# Altium schematic sheet USB High Speed.SchDoc
size A3; Company Name: Renesas Electronics America; CompanyURL: www.renesas.com; PageSetup: Record=PageOptions|CenterHorizontal=True|CenterVertical=True|PrintScale=1.00|XCorrection=1.00|YCorrection=1.00|PrintKind=1|BorderSize=5000000|LeftOffset=0|BottomOffset=0|Orientation=2|PaperLength=1000|PaperWidth=1000|Scale=100|PaperSource=7|PrintQuality=-4|MediaType=1|DitherType=10|PaperKind=A5 148x210mm|PrintScaleMode=1; ReleaseDate: 16.09.2025; Version: MP; SPICEModelCache: <root> / <DocumentId>LYYELOHJ</DocumentId> / </root>; SheetNumber: 14; SheetTotal: 18; VariantNumber: 0; DSheetNumber: 1
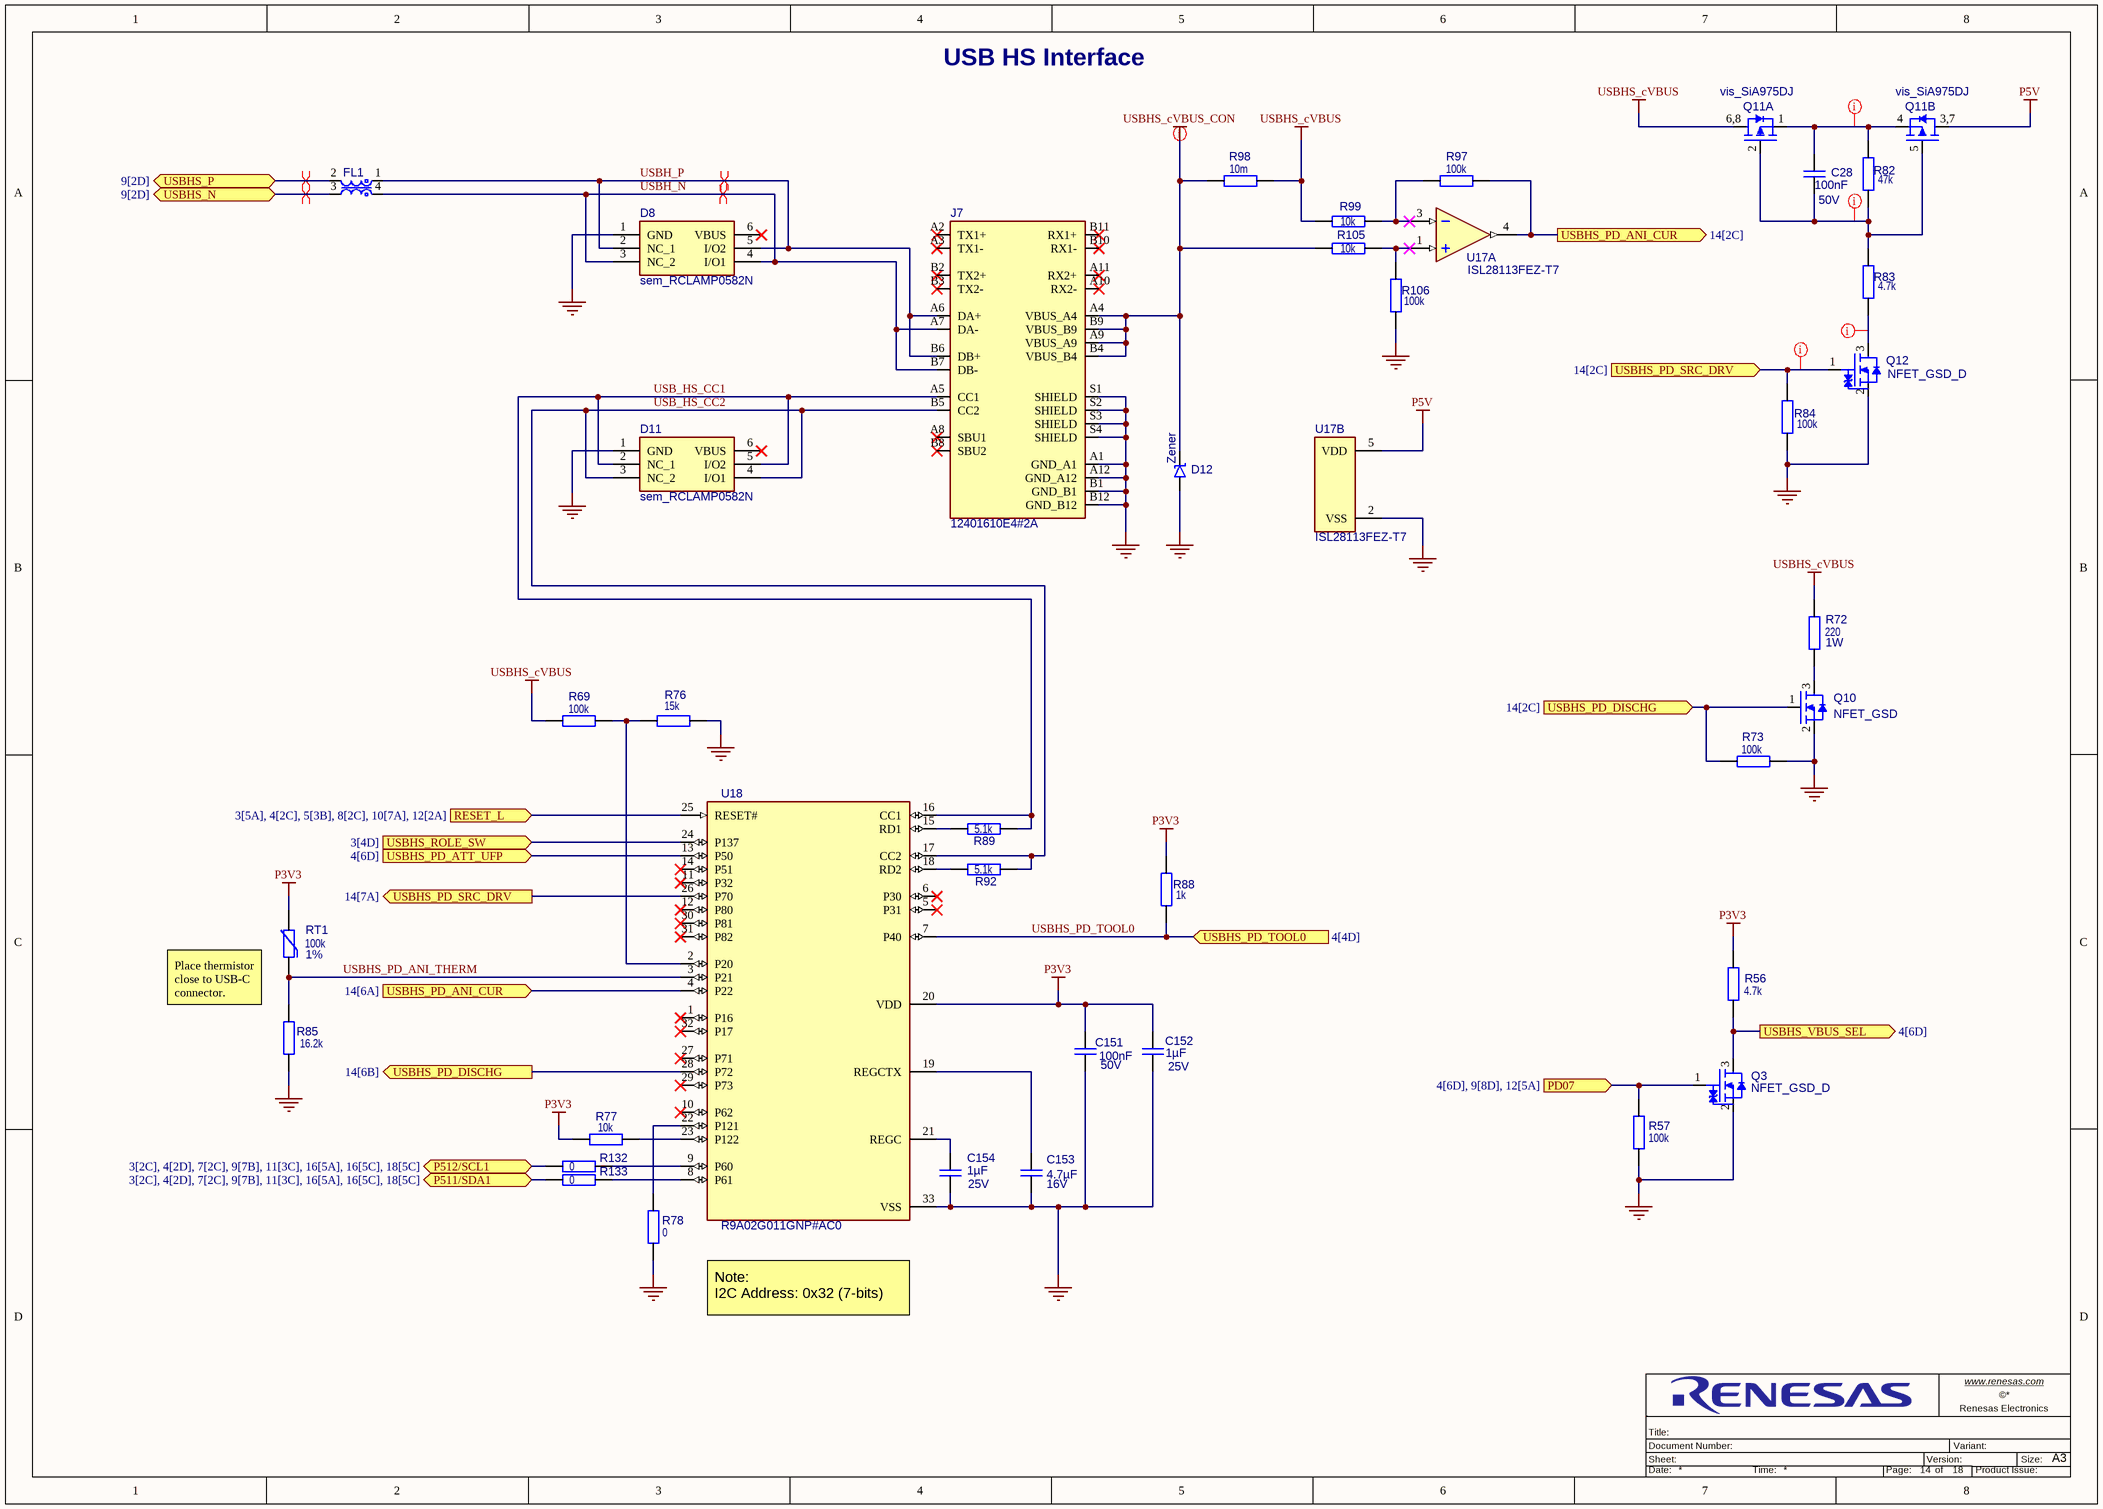
[diagram p0: USB High Speed.SchDoc]

## Parts
C28  value 100nF  Operating Voltage Max: 50V  [C_EIA0402_0p55]  (hidden comment: Capacitor)
C151  value 100nF  Operating Voltage Max: 50V  [C_EIA0402_0p55]  (hidden comment: Capacitor)
C152  value 1µF  Operating Voltage Max: 25V  [C_EIA0402_0p6]  (hidden comment: Capacitor)
C153  value 4.7µF  Operating Voltage Max: 16V  [C_EIA0603_1p0]  (hidden comment: Capacitor)
C154  value 1µF  Operating Voltage Max: 25V  [C_EIA0402_0p6]  (hidden comment: Capacitor)
D8  sem_RCLAMP0582N  [sem_SLP-6_SLP1210N6]
D11  sem_RCLAMP0582N  [sem_SLP-6_SLP1210N6]
D12  Zener  [sem_SGP-2_SGP1610N2]
FL1  CMC_1-2_4-3  [mur_EIA03025]  (value not drawn)
J7  12401610E4#2A  [amp_12401610E42A]
Q3  NFET_GSD_D  [roh_SOT-416FL_SC-89]
Q10  NFET_GSD  [ir_sot-23_3N]
Q11  vis_SiA975DJ  [vis_SC70-6L_Dual]  (parts A,B of 2)
Q12  NFET_GSD_D  [roh_SOT-416FL_SC-89]
R56  value 4.7k  [R_EIA0402]  (hidden comment: Resistor)
R57  value 100k  [R_EIA0402]  (hidden comment: Resistor)
R69  value 100k  [R_EIA0402]  (hidden comment: Resistor)
R72  value 220  Power: 1W  [R_EIA2512]  (hidden comment: Resistor)
R73  value 100k  [R_EIA0402]  (hidden comment: Resistor)
R76  value 15k  [R_EIA0402]  (hidden comment: RC0402FR-0715KL)
R77  value 10k  [R_EIA0402]  (hidden comment: Resistor)
R78  value 0  [R_EIA0402]  (hidden comment: Resistor)
R82  value 47k  [R_EIA0402]  (hidden comment: Resistor)
R83  value 4.7k  [R_EIA0402]  (hidden comment: Resistor)
R84  value 100k  [R_EIA0402]  (hidden comment: Resistor)
R85  value 16.2k  [R_EIA0402]  (hidden comment: Resistor)
R88  value 1k  [R_EIA0402]  (hidden comment: Resistor)
R89  value 5.1k  [R_EIA0402]  (hidden comment: Resistor)
R92  value 5.1k  [R_EIA0402]  (hidden comment: Resistor)
R97  value 100k  [R_EIA0402]  (hidden comment: Resistor)
R98  value 10m  [R_EIA0603]  (hidden comment: Resistor)
R99  value 10k  [R_EIA0402]  (hidden comment: Resistor)
R105  value 10k  [R_EIA0402]  (hidden comment: Resistor)
R106  value 100k  [R_EIA0402]  (hidden comment: Resistor)
R132  value 0  [R_EIA0402]  (hidden comment: Resistor)
R133  value 0  [R_EIA0402]  (hidden comment: Resistor)
RT1  value 100k  Tolerance: 1%  [R_EIA0402]  (hidden comment: Thermistor)
U17  ISL28113FEZ-T7  [ren_SC70-5_P5.049]  (parts A,B of 2)
U18  R9A02G011GNP#AC0  [ren_HVQFN-32_PVQN0032KG-A]

## Ports
P511/SDA1 (bidir, see 3[2C], 4[2D], 7[2C], 9[7B], 11[3C], 16[5A], 16[5C], 18[5C]), P512/SCL1 (bidir, see 3[2C], 4[2D], 7[2C], 9[7B], 11[3C], 16[5A], 16[5C], 18[5C]), PD07 (in, see 4[6D], 9[8D], 12[5A]), RESET_L (in, see 3[5A], 4[2C], 5[3B], 8[2C], 10[7A], 12[2A]), USBHS_N (bidir, see 9[2D]), USBHS_P (bidir, see 9[2D]), USBHS_PD_ANI_CUR (in, see 14[6A]), USBHS_PD_ANI_CUR (out, see 14[2C]), USBHS_PD_ATT_UFP (in, see 4[6D]), USBHS_PD_DISCHG (in, see 14[2C]), USBHS_PD_DISCHG (out, see 14[6B]), USBHS_PD_SRC_DRV (in, see 14[2C]), USBHS_PD_SRC_DRV (out, see 14[7A]), USBHS_PD_TOOL0 (in, see 4[4D]), USBHS_ROLE_SW (in, see 3[4D]), USBHS_VBUS_SEL (out, see 4[6D])

## Nets
GND: C151.2 C152.1 C153.2 C154.1 D8.1(GND) D11.1(GND) D12.2(A) J7.A1(GND_A1) J7.A12(GND_A12) J7.B1(GND_B1) J7.B12(GND_B12) J7.S1(SHIELD) J7.S2(SHIELD) J7.S3(SHIELD) J7.S4(SHIELD) Q3.2(Source) Q10.2(Source) Q12.2(Source) R57.1 R73.2 R76.1 R78.1 R84.1 R85.1 R106.1 U17.2(VSS) U18.33(VSS)
P3V3: C151.1 C152.2 R56.2 R77.2 R88.2 RT1.2 U18.20(VDD)
P5V: Q11.3,7(Drain2) U17.5(VDD)
USBHS_cVBUS: Q11.6,8(Drain1) R69.1 R72.2 R98.2 R99.1
USBHS_cVBUS_CON: D12.1(K) J7.A4(VBUS_A4) J7.A9(VBUS_A9) J7.B4(VBUS_B4) J7.B9(VBUS_B9) R98.1 R105.1
P511/SDA1: R133.2 ; port P511/SDA1
P512/SCL1: R132.2 ; port P512/SCL1
PD07: Q3.1(Gate) R57.2 ; port PD07
RESET_L: U18.25(RESET#) ; port RESET_L
USB_HS_CC1: D11.2(NC_1) D11.5(I/O2) J7.A5(CC1) R89.2 U18.16(CC1)
USB_HS_CC2: D11.3(NC_2) D11.4(I/O1) J7.B5(CC2) R92.2 U18.17(CC2)
USBH_N: D8.3(NC_2) D8.4(I/O1) FL1.4 J7.A7(DA-) J7.B7(DB-)
USBH_P: D8.2(NC_1) D8.5(I/O2) FL1.1 J7.A6(DA+) J7.B6(DB+)
USBHS_N: FL1.3 ; port USBHS_N
USBHS_P: FL1.2 ; port USBHS_P
USBHS_PD_ANI_CUR: R97.2 U17.4(OUT) U18.4(P22) ; port USBHS_PD_ANI_CUR
USBHS_PD_ANI_THERM: R85.2 RT1.1 U18.3(P21)
USBHS_PD_ATT_UFP: U18.13(P50) ; port USBHS_PD_ATT_UFP
USBHS_PD_DISCHG: Q10.1(Gate) R73.1 U18.28(P72) ; port USBHS_PD_DISCHG
USBHS_PD_SRC_DRV: Q12.1(Gate) R84.2 U18.26(P70) ; port USBHS_PD_SRC_DRV
USBHS_PD_TOOL0: R88.1 U18.7(P40) ; port USBHS_PD_TOOL0
USBHS_ROLE_SW: U18.24(P137) ; port USBHS_ROLE_SW
USBHS_VBUS_SEL: Q3.3(Drain) R56.1 ; port USBHS_VBUS_SEL
NetC28_1: C28.1 Q11.2(Gate1) Q11.5(Gate2) R82.1 R83.2
NetC28_2: C28.2 Q11.1(Source1) Q11.4(Source2) R82.2
NetC153_1: C153.1 U18.19(REGCTX)
NetC154_2: C154.2 U18.21(REGC)
NetQ10_3: Q10.3(Drain) R72.1
NetQ12_3: Q12.3(Drain) R83.1
NetR69_2: R69.2 R76.2 U18.2(P20)
NetR77_1: R77.1 U18.23(P122)
NetR78_2: R78.2 U18.22(P121)
NetR89_1: R89.1 U18.15(RD1)
NetR92_1: R92.1 U18.18(RD2)
NetR97_1: R97.1 R99.2 U17.3(IN-)
NetR105_2: R105.2 R106.2 U17.1(IN+)
NetR132_1: R132.1 U18.9(P60)
NetR133_1: R133.1 U18.8(P61)

Not connected (* = marked no-connect by the designer): D8 6(VBUS)*; D11 6(VBUS)*; J7 A2(TX1+)* A3(TX1-)* A8(SBU1)* A10(RX2-)* A11(RX2+)* B2(TX2+)* B3(TX2-)* B8(SBU2)* B10(RX1-)* B11(RX1+)*; U18 1(P16)* 5(P31)* 6(P30)* 10(P62)* 11(P32)* 12(P80)* 14(P51)* 27(P71)* 29(P73)* 30(P81)* 31(P82)* 32(P17)*

## Layout directives
differential pair; differential pair class USB: USBH_N, USBH_P, USBHS_N, USBHS_P
net class Power: NetC28_2
net class Power_Control: NetC28_1, NetQ12_3, USBHS_PD_SRC_DRV
net class Power; rule Supply Nets [Voltage = 5.000]: USBHS_cVBUS_CON

## Notes on the sheet
- USB HS Interface
- Place thermistor close to USB-C connector.
- Note:
  I2C Address: 0x32 (7-bits)
- www.renesas.com <http://www.renesas.com>
- Sheet:
- Title:
- Document Number:
- Version:
- Variant:
- Renesas Electronics
- Size:
- A3
- Date:
- Time:
- Page:
- of
- Product Issue:

## Library data of the parts
C28 C151 = CAP-00003203-9: Capacitor,EIA0402,100n,50V,X7R; Tolerance: 10%; Qualification: AEC-Q200; Subtype: MLCC; Dielectric: X7R; Height: 550µm; Operating Temperature Max: 125°C; Operating Temperature Min: -55°C
C152 C154 = CAP-00000014-5: Capacitor,EIA0402,1u,25V,X6S; Tolerance: 10%; Qualification: AEC-Q200; Subtype: MLCC; Dielectric: X6S; Height: 600µm; Operating Temperature Max: 105°C; Operating Temperature Min: -55°C
C153 = CAP-00003210-8: Capacitor,EIA0603,4.7u,16V,X7S; Tolerance: 10%; Qualification: AEC-Q200; Subtype: MLCC; Dielectric: X7S; Height: 1mm; Operating Temperature Max: 125°C; Operating Temperature Min: -55°C
D8 D11 = DIO-00003463-14: Low Capacitance TVS Diode Array; Qualification: AEC-Q100; Reverse Voltage: 6.5V; Subtype: ESD; Height: 580µm; Operating Temperature Max: 125°C; Operating Temperature Min: -40°C
D12 = DIO-00000001-5: ESD Suppressor Diode TVS Uni-Dir 22V 55Vc Automotive 2-Pin SGP T/R; Qualification: AEC-Q100; Height: 550µm; Operating Temperature Max: 125°C; Operating Temperature Min: -40°C; Reverse Voltage: 22V; Subtype: ESD
FL1 = IND-00000004-4: Common Mode Choke / Filters, 90uH 25%, 0.1A, 3.8Ohm DCR; Current: 100mA; DC Resistance: 3.8; Frequency: 100MHz; Subtype: CMC; Value: 90; Tolerance: 25%; Height: 450mm; Operating Temperature Max: 85°C; Operating Temperature Min: -40°C; Qualification: -
J7 = CON-00000065-5: Connector USB 3.2 Gen2 Type C Horizontal SMD; Gender: female; Current: 5A; Operating Voltage Max: 20V; Pin Count: 24; Operating Temperature Max: 85°C; Qualification: -; Operating Temperature Min: -40°C; Height: 3.43mm
Q3 Q12 = TRA-00000001-2: N-Channel 60V 250mA Small Signal MOSFET; DC Resistance: 2.4; Gate Voltage Threshold Max: 2.3V; Gate Voltage Threshold Min: 1V; Input Capacitance: 15pF; Power: 150mW; Subtype: NMOS; Current: 250mA; Operating Temperature Max: 150°C; Operating Temperature Min: -55°C; Operating Voltage Max: 60V; Pin Count: 3; Qualification: -
Q10 = TRA-00000004-3: N-Channel 30V 5A 1.3W MOSFET; DC Resistance: 29m; Gate Voltage Threshold Max: 1.1V; Gate Voltage Threshold Min: 500mV; Input Capacitance: 650pF; Subtype: NMOS; Current: 5A; Operating Temperature Max: 150°C; Operating Temperature Min: -55°C; Operating Voltage Max: 30V; Pin Count: 3; Power: 1.3W; Qualification: -
Q11 = TRA-00000003-7: Dual P-Channel -12V -4.5A MOSFET; DC Resistance: 0.11; Gate Voltage Threshold Max: -1V; Gate Voltage Threshold Min: -400mV; Input Capacitance: 1.5nF; Power: 1.9W; Subtype: PMOS; Current: -4.5A; Operating Temperature Max: 150°C; Operating Temperature Min: -55°C; Operating Voltage Max: -12V; Pin Count: 6; Qualification: -
R56 R83 = RES-00000894-9: Resistor,EIA0402,4.7k,0.0625W; Power: 62.5mW; Tolerance: 1%; Subtype: Chip Resistor; Operating Temperature Max: 155°C; Operating Temperature Min: -55°C; Qualification: -
R57 R69 R73 R84 R97 R106 = RES-00000926-9: Resistor,EIA0402,100k,0.0625W; Power: 62.5mW; Tolerance: 1%; Subtype: Chip Resistor; Operating Temperature Max: 155°C; Operating Temperature Min: -55°C; Qualification: -
R72 = RES-00003204-2: Resistor,EIA2512,220,1W; Tolerance: 1%; Operating Voltage Max: 200V; Qualification: AEC-Q100; Subtype: Chip Resistor; Height: 750µm; Operating Temperature Max: 155°C; Operating Temperature Min: -55°C; Temperature Coefficient: -
R76 = RES-00000906-9: Resistor,EIA0402,15k,0.0625W; Tolerance: 1%; Power: 62.5mW; Subtype: Chip Resistor; Operating Temperature Min: -55°C; Qualification: -; Operating Temperature Max: 155°C
R77 R99 R105 = RES-00000902-9: Resistor,EIA0402,10k,0.0625W; Power: 62.5mW; Tolerance: 1%; Subtype: Chip Resistor; Operating Temperature Max: 155°C; Operating Temperature Min: -55°C; Qualification: -
R78 R132 R133 = RES-00000801-9: Resistor,EIA0402,0,0.0625W; Power: 62.5mW; Tolerance: 5%; Subtype: Chip Resistor; Operating Temperature Max: 155°C; Operating Temperature Min: -55°C; Qualification: -
R82 = RES-00000918-9: Resistor,EIA0402,47k,0.0625W; Power: 62.5mW; Tolerance: 1%; Subtype: Chip Resistor; Operating Temperature Max: 155°C; Operating Temperature Min: -55°C; Qualification: -
R85 = RES-00001689-10: Resistor,EIA0402,16.2k,0.0625W; Power: 62.5mW; Tolerance: 1%; Subtype: Chip Resistor; Operating Temperature Max: 155°C; Operating Temperature Min: -55°C; Qualification: -
R88 = RES-00000878-9: Resistor,EIA0402,1k,0.0625W; Power: 62.5mW; Tolerance: 1%; Subtype: Chip Resistor; Operating Temperature Max: 155°C; Operating Temperature Min: -55°C; Qualification: -
R89 R92 = RES-00000895-9: Resistor,EIA0402,5.1k,0.0625W; Power: 62.5mW; Tolerance: 1%; Subtype: Chip Resistor; Operating Temperature Max: 155°C; Operating Temperature Min: -55°C; Qualification: -
R98 = RES-00003205-3: Resistor,EIA0603,10m,0.25W; Power: 250mW; Tolerance: 1%; Qualification: AEC-Q200; Subtype: Chip Resistor; Height: 700µm; Operating Temperature Max: 125°C; Operating Temperature Min: -55°C
RT1 = RES-00000000-6: NTC Thermistor, R_EIA0402, 100K, 4250K; Operating Voltage Max: 5V; Power: 160µW; Height: 550µm; Operating Temperature Max: 125°C; Operating Temperature Min: -40°C; Qualification: -; Subtype: Thermistor
U17 = ICS-00000015-3: Single, General Purpose Micropower, RRIO Operational Amplifier; Frequency: 2MHz; Operating Voltage Max: 5.5V; Operating Voltage Min: 1.8V; Subtype: Power; Operating Temperature Max: 125°C; Operating Temperature Min: -40°C; Output Voltage Max: 5.5V; Pin Count: 5; Qualification: -
U18 = ICS-00000018-7: USB Power Delivery Controller, USB 3.1, HVQFN32; Frequency: 24MHz; Operating Voltage Max: 5.5V; Operating Voltage Min: 3V; Output Voltage Min: 0V; Subtype: Digital; Operating Temperature Max: 105°C; Operating Temperature Min: -40°C; Output Voltage Max: 5.5V; Pin Count: 33; Qualification: -